# EAGLE design i2c_rgblcd_panel (EAGLE 5.09)
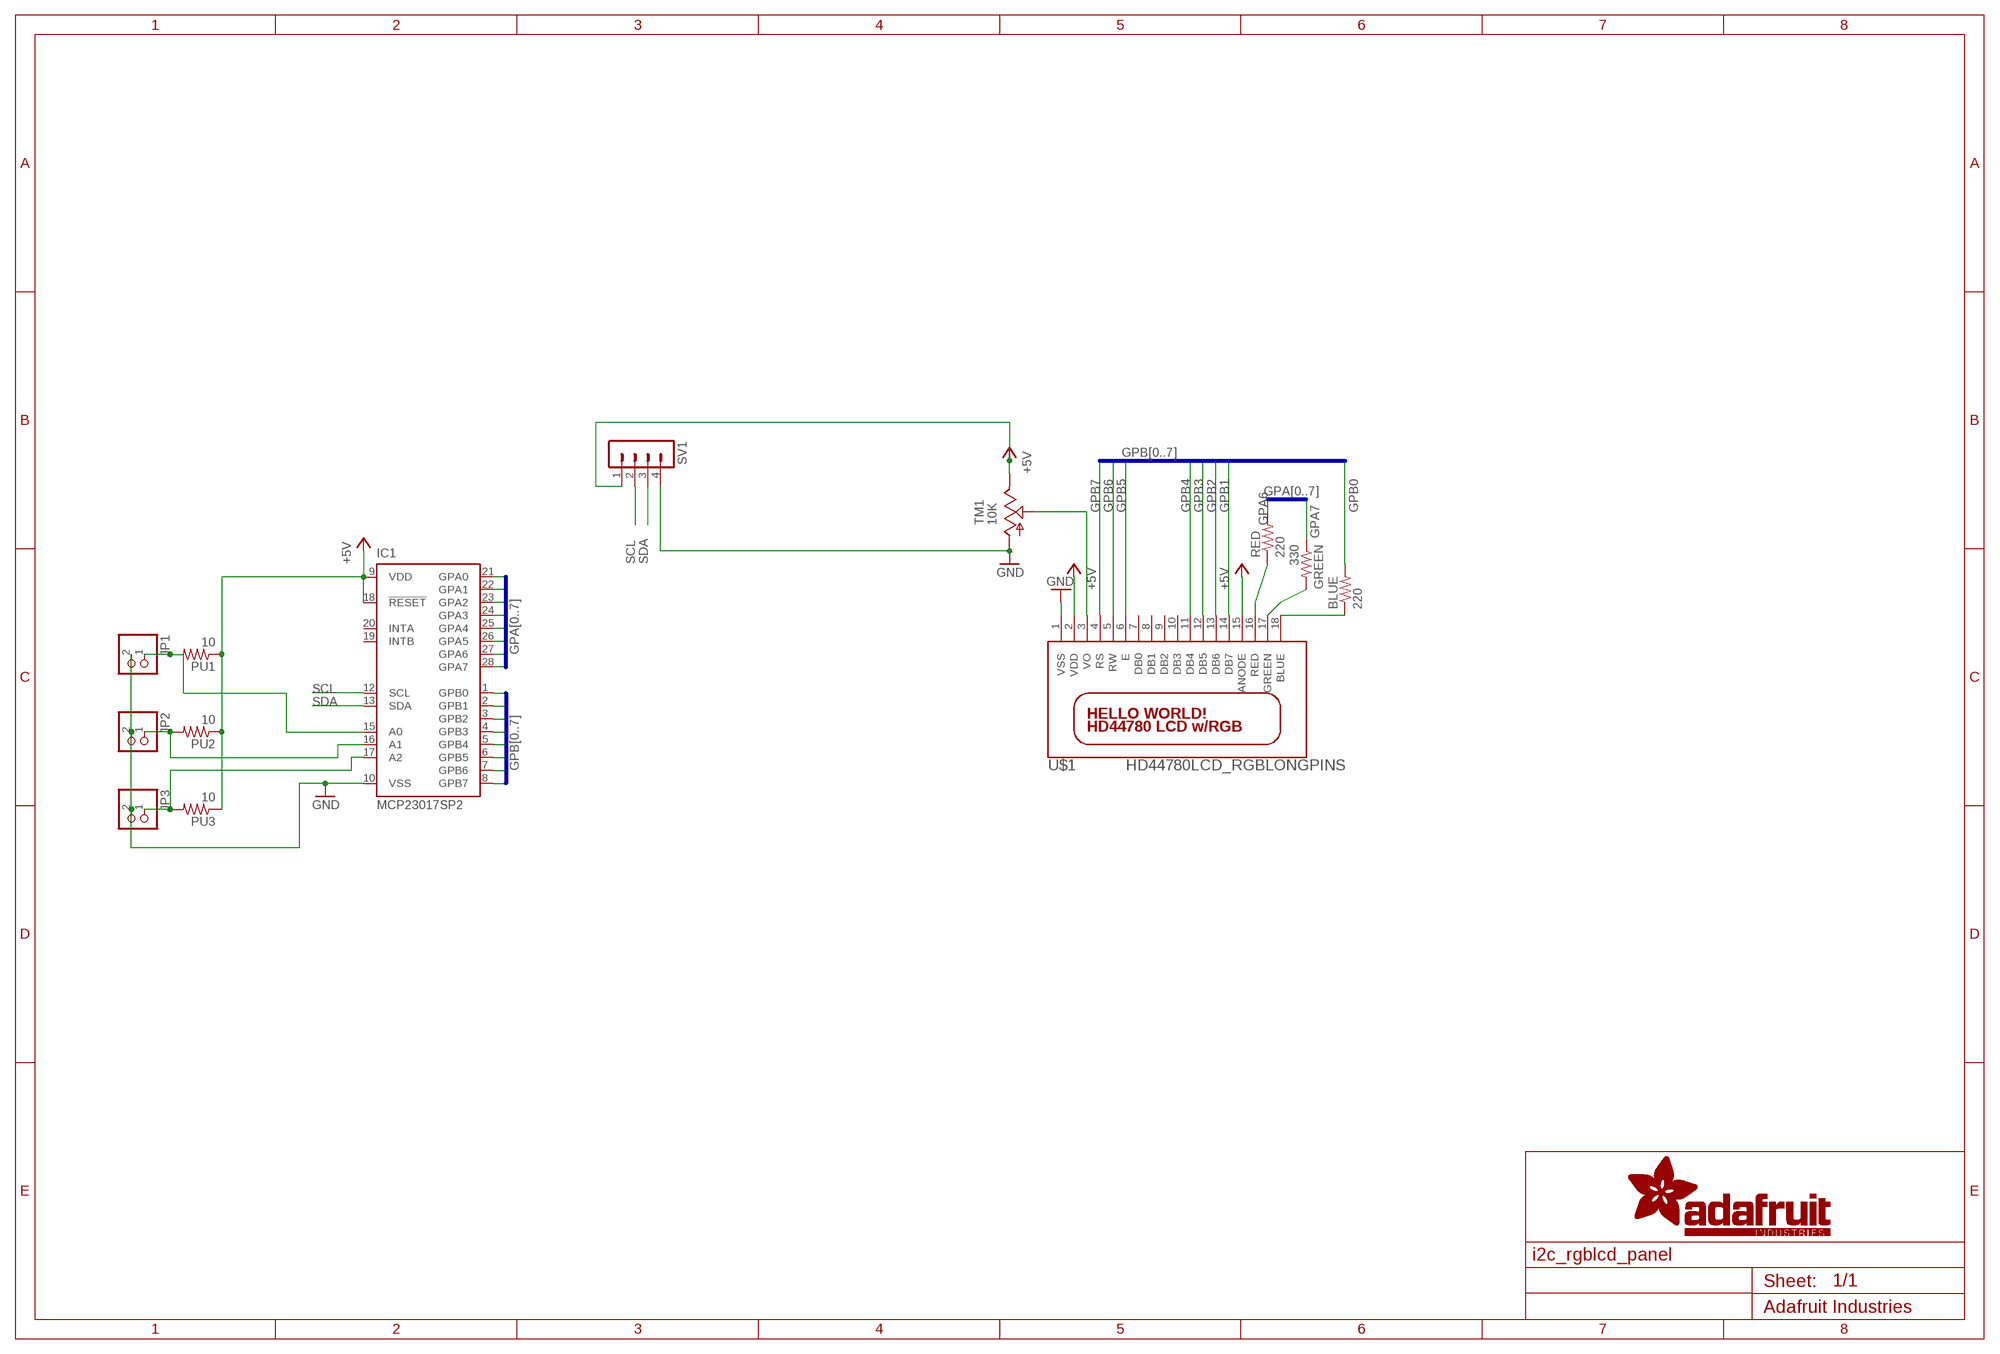
[diagram p0: schematic, sheet 1]

## Parts
BLUE  220  R-US_0207/10  [0207/10]
GREEN  330  R-US_0207/10  [0207/10]
IC1  MCP23017SP2  [DIL28-3-ROUND]
JP1  PINHD-1X2  [1X02]
JP2  PINHD-1X2  [1X02]
JP3  PINHD-1X2  [1X02]
PU1  10  R-US_0207/10  [0207/10]
PU2  10  R-US_0207/10  [0207/10]
PU3  10  R-US_0207/10  [0207/10]
RED  220  R-US_0207/10  [0207/10]
SV1  MA04-1  [MA04-1]
TM1  10K  TRIM  [6MM]
U$1  HD44780LCD_RGBLONGPINS  [LCD1602-RGB]

## Nets
+5V: IC1.9(VDD) IC1.18(!RESET) PU1.1 PU2.1 PU3.1 SV1.1 TM1.E U$1.2(VDD) U$1.15(ANODE)
GND: IC1.10(VSS) JP1.2 JP2.2 JP3.2 SV1.4 TM1.A U$1.1(VSS)
GPA0: IC1.21(GPA0)
GPA1: IC1.22(GPA1)
GPA2: IC1.23(GPA2)
GPA3: IC1.24(GPA3)
GPA4: IC1.25(GPA4)
GPA5: IC1.26(GPA5)
GPA6: IC1.27(GPA6) RED.2
GPA7: GREEN.1 IC1.28(GPA7)
GPB0: BLUE.2 IC1.1(GPB0)
GPB1: IC1.2(GPB1) U$1.14(DB7)
GPB2: IC1.3(GPB2) U$1.13(DB6)
GPB3: IC1.4(GPB3) U$1.12(DB5)
GPB4: IC1.5(GPB4) U$1.11(DB4)
GPB5: IC1.6(GPB5) U$1.6(E)
GPB6: IC1.7(GPB6) U$1.5(RW)
GPB7: IC1.8(GPB7) U$1.4(RS)
N$1: IC1.15(A0) JP1.1 PU1.2
N$2: BLUE.1 U$1.18(BLUE)
N$3: GREEN.2 U$1.17(GREEN)
N$4: RED.1 U$1.16(RED)
N$5: TM1.S U$1.3(VO)
N$6: IC1.16(A1) JP2.1 PU2.2
N$7: IC1.17(A2) JP3.1 PU3.2
SCL: IC1.12(SCL) SV1.2
SDA: IC1.13(SDA) SV1.3
Unconnected: IC1.19(INTB) IC1.20(INTA) U$1.7(DB0) U$1.8(DB1) U$1.9(DB2) U$1.10(DB3)

## Buses
GPB[0..7]
GPA[0..7]

## Library data of the parts
BLUE GREEN PU1-PU3 RED = adafruit:R-US_: RESISTOR, American symbol
IC1 = adafruit:MCP23017: http://ww1.microchip.com/downloads/en/DeviceDoc/21952a.pdf Source: http://ww1.microchip.com/downloads/en/DeviceDoc/21952a.pdf
JP1-JP3 = pinhead:PINHD-1X2: PIN HEADER
SV1 = con-lstb:MA04-1: PIN HEADER
TM1 = adafruit:TRIM
U$1 = adafruit:HD44780LCD_RGB

## Board
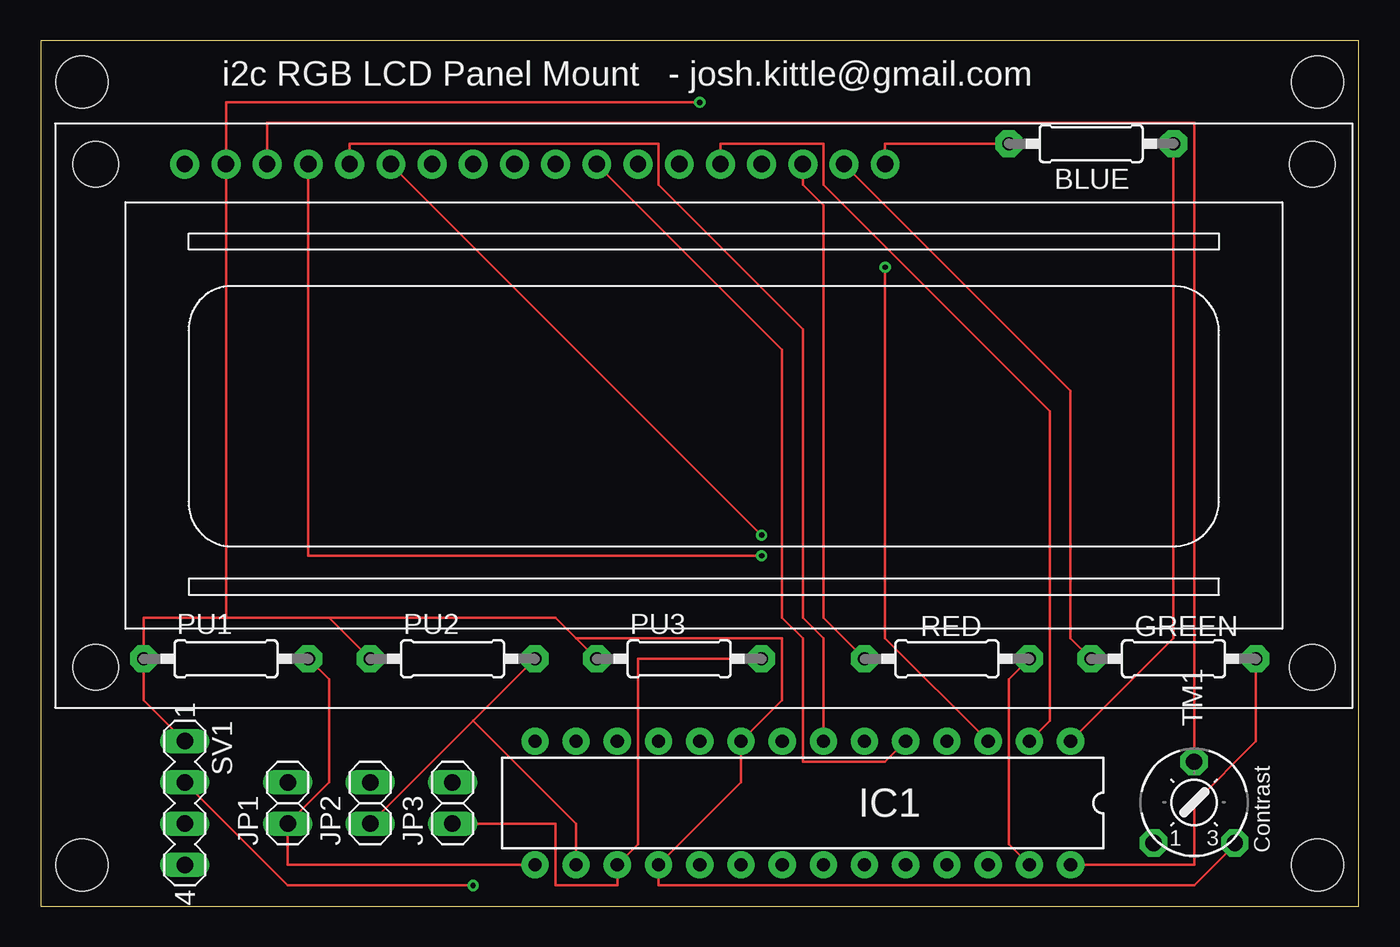
[diagram p1: board, top side]
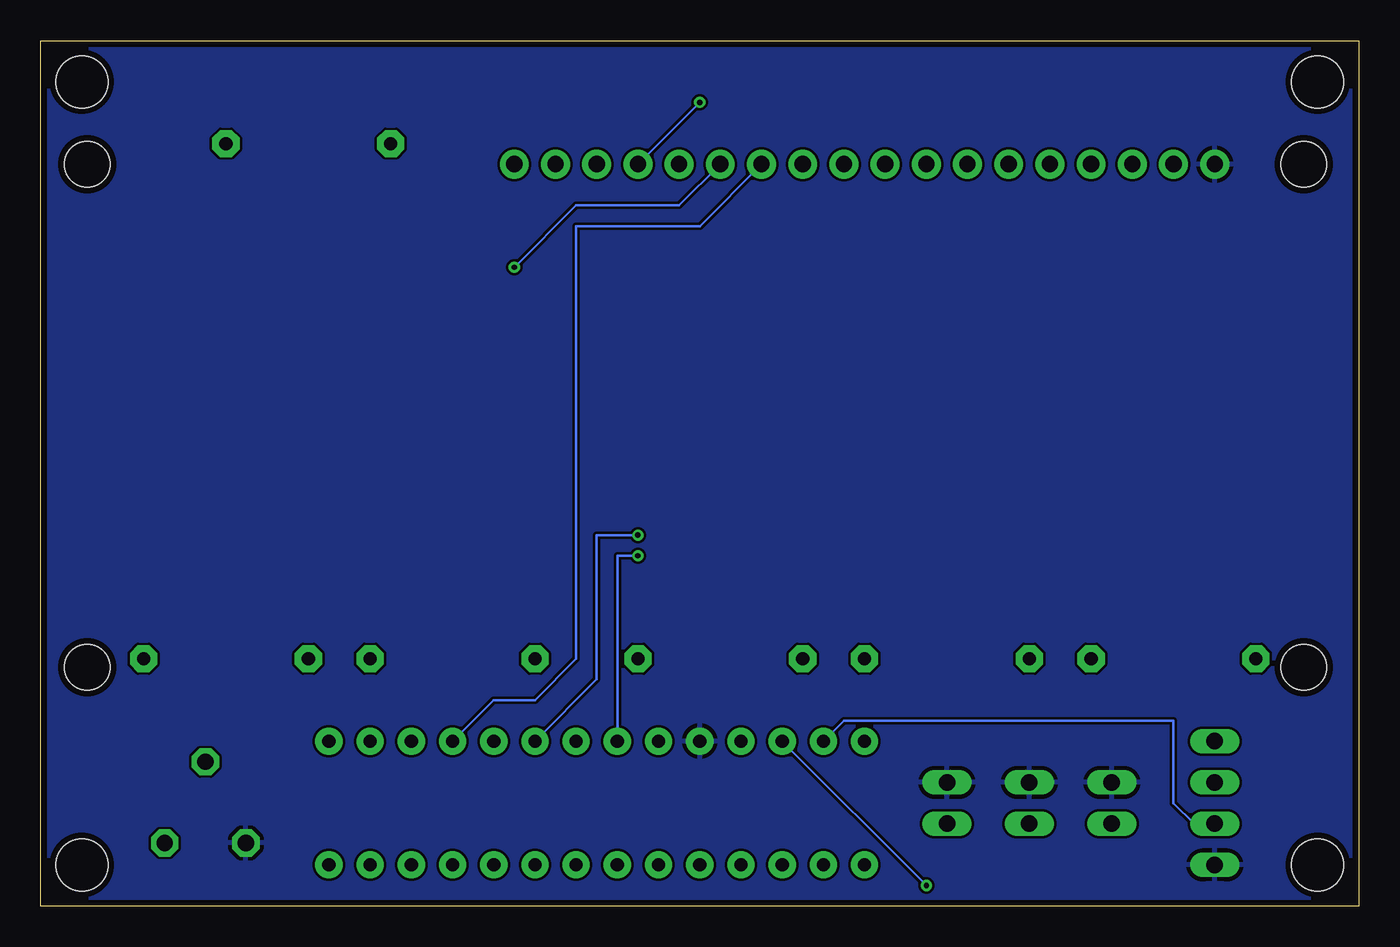
[diagram p2: board, bottom side, seen from below]

Size 81.28 x 53.34 mm. Coordinates in mm from the lower left corner, seen from the top.
Outline: 0,0 81.28,0 81.28,53.34 0,53.34 0,0
Copper layers (1*16): Top 0.0356mm / dielectric 1.5011mm / Bottom 0.0356mm
Design rules "LaenPCBOrder": minimum track width 6mil, minimum drill 13mil, track to track 6mil, track to pad 6mil, pad to pad 6mil, via to via 6mil, smd to smd 6mil, copper to edge 15mil, drill to drill 6mil, minimum pad ring 7mil, minimum via ring 7mil, stop-mask expansion 4mil, vias tented up to drill 0mil, thermal gap 10mil
Holes 3.2 mm at 2.54,50.8 78.74,50.8 78.74,2.54 2.54,2.54

### Footprints (pad centres in the part's own frame; a part is rotated, then mirrored left to right if it is on the bottom)
0207/10 = drill 0.813 pad 1.676 octagon: 1 -5.08,0; 2 5.08,0
DIL28-3-ROUND = drill 0.813 pad 1.676 round: 1 -16.51,-3.81; 2 -13.97,-3.81; 3 -11.43,-3.81; 4 -8.89,-3.81; 5 -6.35,-3.81; 6 -3.81,-3.81; 7 -1.27,-3.81; 8 1.27,-3.81; 9 3.81,-3.81; 10 6.35,-3.81; 11 8.89,-3.81; 12 11.43,-3.81; 13 13.97,-3.81; 14 16.51,-3.81; 15 16.51,3.81; 16 13.97,3.81; 17 11.43,3.81; 18 8.89,3.81; 19 6.35,3.81; 20 3.81,3.81; 21 1.27,3.81; 22 -1.27,3.81; 23 -3.81,3.81; 24 -6.35,3.81; 25 -8.89,3.81; 26 -11.43,3.81; 27 -13.97,3.81; 28 -16.51,3.81
1X02 = drill 1.016 long: 1 -1.27,0; 2 1.27,0
MA04-1 = drill 1.016 long: 1 -3.81,0; 2 -1.27,0; 3 1.27,0; 4 3.81,0
6MM = drill 1 pad 1.676 octagon: A -2.5,-2.5; E 2.5,-2.5; S 0,2.5
LCD1602-RGB = drill 1 pad 1.778 round: 1 -32,15.5; 2 -29.46,15.5; 3 -26.92,15.5; 4 -24.38,15.5; 5 -21.84,15.5; 6 -19.3,15.5; 7 -16.76,15.5; 8 -14.22,15.5; 9 -11.68,15.5; 10 -9.14,15.5; 11 -6.6,15.5; 12 -4.06,15.5; 13 -1.52,15.5; 14 1.02,15.5; 15 3.56,15.5; 16 6.1,15.5; 17 8.64,15.5; 18 11.18,15.5 | hole 2.8: -37.5,-15.5; -37.5,15.5; 37.5,15.5; 37.5,-15.5

### Placement (x,y rotation side)
BLUE  64.77,46.99 0 top
GREEN  69.85,15.24 180 top
IC1  46.99,6.35 180 top
JP1  15.24,6.35 90 top
JP2  20.32,6.35 90 top
JP3  25.4,6.35 90 top
PU1  11.43,15.24 0 top
PU2  25.4,15.24 0 top
PU3  39.37,15.24 0 top
RED  55.88,15.24 0 top
SV1  8.89,6.35 270 top
TM1  71.12,6.39 0 top
U$1  40.89,30.23 0 top

### Tracks (layer width: path | path; a pad name or v marks a point on that pad's centre or on a via)
+5V  (via drill 0.33)
  Top 0.152: TM1.E 73.66,3.81 71.12,1.27 38.1,1.27 IC1.18 43.18,7.62 IC1.9 45.72,12.7 45.72,16.51 33.02,16.51 | SV1.1 6.35,12.7 PU1.1 6.35,17.78 11.43,17.78 | 17.78,17.78 PU2.1 | 11.43,17.78 17.78,17.78 | 33.02,16.51 31.75,17.78 17.78,17.78 | 33.02,16.51 PU3.1 | 11.43,17.78 U$1.2 | v40.64,49.53 11.43,49.53 U$1.2 | U$1.2
  Bottom 0.152: v40.64,49.53 U$1.15
GND
  pour Bottom: 0,53.47 0,0 81.28,0 81.28,53.34
GPA6
  Top 0.152: IC1.27 59.69,3.81 59.69,13.97 RED.2
GPA7
  Top 0.152: IC1.28 71.12,2.54 71.12,6.35 74.93,10.16 GREEN.1
GPB0
  Top 0.152: IC1.1 69.85,16.51 BLUE.2
GPB1
  Top 0.152: IC1.2 62.23,11.43 62.23,30.48 48.26,44.45 48.26,46.99 41.91,46.99 U$1.14
GPB2  (via drill 0.33)
  Top 0.152: IC1.3 52.07,16.51 v52.07,39.37
  Bottom 0.152: v52.07,39.37 48.26,43.18 41.91,43.18 U$1.13
GPB3
  Bottom 0.152: IC1.4 53.34,12.7 50.8,12.7 48.26,15.24 48.26,41.91 40.64,41.91 U$1.12
GPB4
  Top 0.152: IC1.5 52.07,8.89 46.99,8.89 46.99,16.51 45.72,17.78 45.72,34.29 U$1.11
GPB5  (via drill 0.33)
  Top 0.152: v44.45,22.86 U$1.6
  Bottom 0.152: IC1.6 46.99,13.97 46.99,22.86 v44.45,22.86
GPB6
  Top 0.152: IC1.7 48.26,16.51 46.99,17.78 46.99,35.56 38.1,44.45 38.1,46.99 19.05,46.99 U$1.5
GPB7  (via drill 0.33)
  Top 0.152: v44.45,21.59 16.51,21.59 U$1.4
  Bottom 0.152: IC1.8 45.72,21.59 v44.45,21.59
N$1
  Top 0.152: PU1.2 17.78,13.97 17.78,7.62 JP1.1 15.24,2.54 IC1.15
N$2
  Top 0.152: BLUE.1 52.07,46.99 U$1.18
N$3
  Top 0.152: GREEN.2 63.5,16.51 63.5,31.75 U$1.17
N$4
  Top 0.152: RED.1 48.26,17.78 48.26,43.18 46.99,44.45 U$1.16
N$5
  Top 0.152: TM1.S 71.12,48.26 13.97,48.26 U$1.3
N$6
  Top 0.152: 26.67,11.43 PU2.2 | JP2.1 26.67,11.43 | IC1.16 33.02,5.08 26.67,11.43
N$7
  Top 0.152: JP3.1 31.75,5.08 31.75,1.27 35.56,1.27 IC1.17 36.83,3.81 36.83,15.24 PU3.2
SCL  (via drill 0.33)
  Top 0.152: SV1.2 15.24,1.27 v26.67,1.27
  Bottom 0.152: v26.67,1.27 IC1.12
SDA
  Bottom 0.152: SV1.3 10.16,5.08 11.43,6.35 11.43,11.43 31.75,11.43 IC1.13

### Text on the board
tPlace: i2c RGB LCD Panel Mount - josh.kittle@gmail.com | Contrast